# Altium project PIC Circuit.PrjPcb
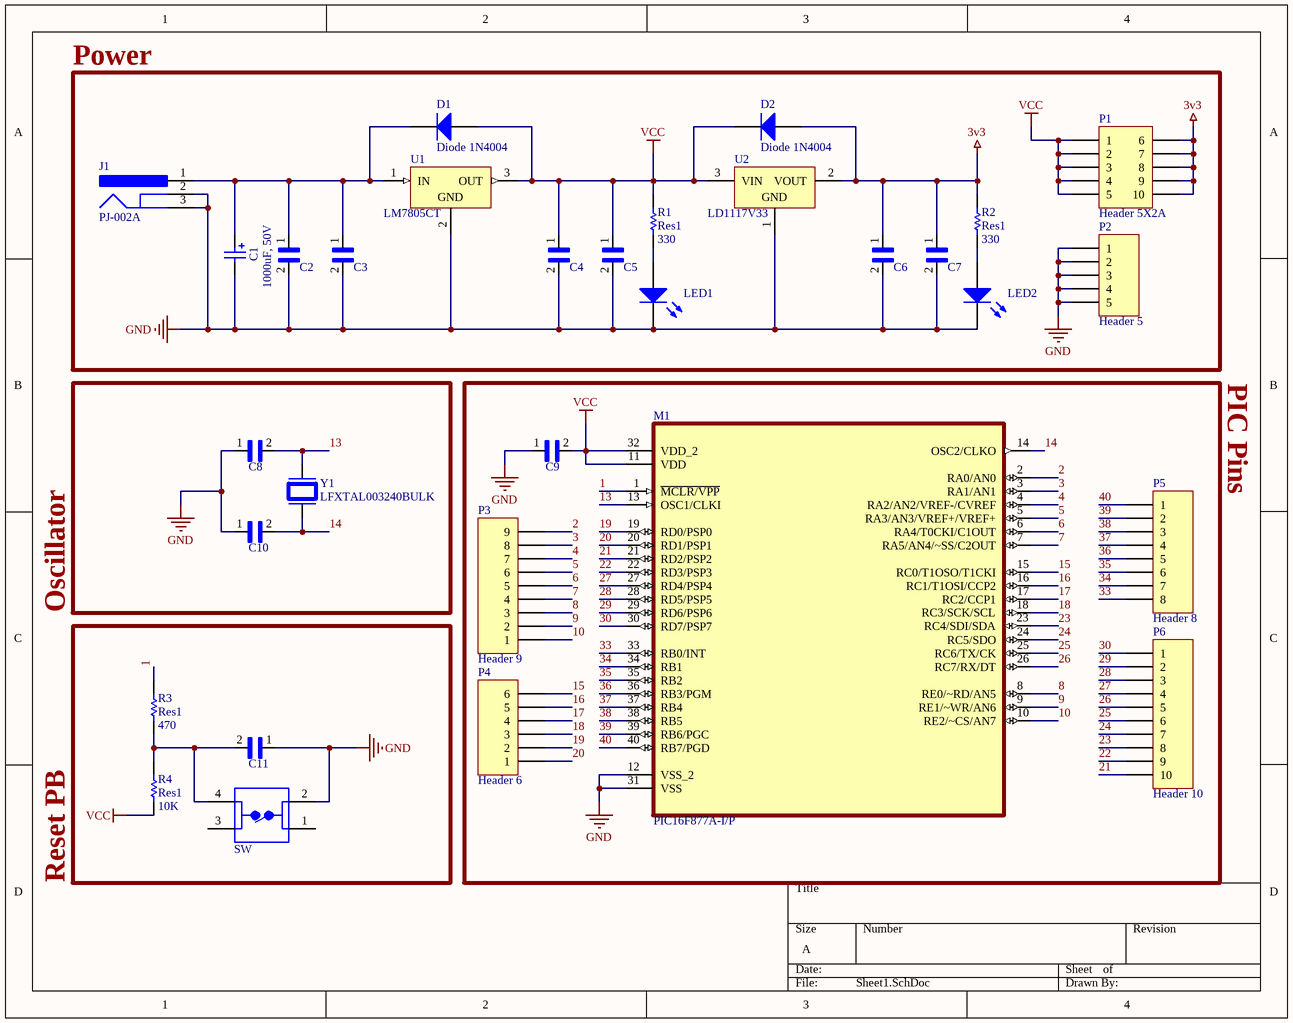
[diagram p0: Sheet1.SchDoc]
1 sheet, 31 parts. Net scope: global (net labels, ports and power ports of the same name join across sheets).
Board file: PCB1.PcbDoc

## Sheet Sheet1.SchDoc
size A; SheetNumber: 1; SheetTotal: 1

### Parts
C1  1000uF, 50V  [WCAP-ATG8_D13H25]
C2  RDE5C2A220J0M1H03A  [CAP_RDE5C2A220J0M1H03A]  (value not drawn)
C3  RDE5C2A220J0M1H03A  [CAP_RDE5C2A220J0M1H03A]  (value not drawn)
C4  RDE5C2A220J0M1H03A  [CAP_RDE5C2A220J0M1H03A]  (value not drawn)
C5  RDE5C2A220J0M1H03A  [CAP_RDE5C2A220J0M1H03A]  (value not drawn)
C6  RDE5C2A220J0M1H03A  [CAP_RDE5C2A220J0M1H03A]  (value not drawn)
C7  RDE5C2A220J0M1H03A  [CAP_RDE5C2A220J0M1H03A]  (value not drawn)
C8  RDE5C2A220J0M1H03A  [CAP_RDE5C2A220J0M1H03A]  (value not drawn)
C9  RDE5C2A220J0M1H03A  [CAP_RDE5C2A220J0M1H03A]  (value not drawn)
C10  RDE5C2A220J0M1H03A  [CAP_RDE5C2A220J0M1H03A]  (value not drawn)
C11  RDE5C2A220J0M1H03A  [CAP_RDE5C2A220J0M1H03A]  (value not drawn)
D1  Diode 1N4004  [DO-41]
D2  Diode 1N4004  [DO-41]
J1  PJ-002A  [CUI-PJ-002A_V]
LED1  151031SS06000  [Type 3mm]  (value not drawn)
LED2  151031SS06000  [Type 3mm]  (value not drawn)
M1  PIC16F877A-I/P  [DIP254P1524X483-40]
P1  Header 5X2A  [HDR2X5_CEN]
P2  Header 5  [HDR1X5]
P3  Header 9  [HDR1X9]
P4  Header 6  [HDR1X6]
P5  Header 8  [HDR1X8]
P6  Header 10  [HDR1X10]
R1  Res1  value 330  [AXIAL-0.3]
R2  Res1  value 330  [AXIAL-0.3]
R3  Res1  value 470  [AXIAL-0.3]
R4  Res1  value 10K  [AXIAL-0.3]
SW  3-1825910-1  [TE_3-1825910-1]  (value not drawn)
U1  LM7805CT  [FAIR-TO-220-3]
U2  LD1117V33  [TO220]
Y1  LFXTAL003240BULK  [HC49P488W45L1105T470H410]

### Blocks framed on the sheet
Power: C1-C7 D1 D2 J1 LED1 LED2 P1 P2 R1 R2 U1 U2
Oscillator: C8 C10 Y1
PIC Pins: C9 M1 P3-P6
Reset PB: C11 R3 R4 SW

### Nets
3v3: C6.1 C7.1 D2.1(A) P1.6 P1.7 P1.8 P1.9 P1.10 R2.1 U2.2(VOUT)
GND: C1.2(N) C2.2 C3.2 C4.2 C5.2 C6.2 C7.2 C8.1 C9.1 C10.1 C11.1 J1.2 J1.3 LED1.1(K) LED2.1(K) M1.12(VSS_2) M1.31(VSS) P2.1 P2.2 P2.3 P2.4 P2.5 SW.2 U1.2(GND) U2.1(GND)
VCC: C4.1 C5.1 C9.2 D1.1(A) D2.2(K) M1.11(VDD) M1.32(VDD_2) P1.1 P1.2 P1.3 P1.4 P1.5 R1.1 R4.1 U1.3(OUT) U2.3(VIN)
1: M1.1(~{MCLR/VPP}) R3.2
2: M1.2(RA0/AN0) P3.9
3: M1.3(RA1/AN1) P3.8
4: M1.4(RA2/AN2/VREF-/CVREF) P3.7
5: M1.5(RA3/AN3/VREF+/VREF+) P3.6
6: M1.6(RA4/T0CKI/C1OUT) P3.5
7: M1.7(RA5/AN4/~SS/C2OUT) P3.4
8: M1.8(RE0/~RD/AN5) P3.3
9: M1.9(RE1/~WR/AN6) P3.2
10: M1.10(RE2/~CS/AN7) P3.1
13: C8.2 M1.13(OSC1/CLKI) Y1.2
14: C10.2 M1.14(OSC2/CLKO) Y1.1
15: M1.15(RC0/T1OSO/T1CKI) P4.6
16: M1.16(RC1/T1OSI/CCP2) P4.5
17: M1.17(RC2/CCP1) P4.4
18: M1.18(RC3/SCK/SCL) P4.3
19: M1.19(RD0/PSP0) P4.2
20: M1.20(RD1/PSP1) P4.1
21: M1.21(RD2/PSP2) P6.10
22: M1.22(RD3/PSP3) P6.9
23: M1.23(RC4/SDI/SDA) P6.8
24: M1.24(RC5/SDO) P6.7
25: M1.25(RC6/TX/CK) P6.6
26: M1.26(RC7/RX/DT) P6.5
27: M1.27(RD4/PSP4) P6.4
28: M1.28(RD5/PSP5) P6.3
29: M1.29(RD6/PSP6) P6.2
30: M1.30(RD7/PSP7) P6.1
33: M1.33(RB0/INT) P5.8
34: M1.34(RB1) P5.7
35: M1.35(RB2) P5.6
36: M1.36(RB3/PGM) P5.5
37: M1.37(RB4) P5.4
38: M1.38(RB5) P5.3
39: M1.39(RB6/PGC) P5.2
40: M1.40(RB7/PGD) P5.1
NetC1_1: C1.1(P) C2.1 C3.1 D1.2(K) J1.1 U1.1(IN)
NetC11_2: C11.2 R3.1 R4.2 SW.4
NetLED1_2: LED1.2(A) R1.2
NetLED2_2: LED2.2(A) R2.2

Not connected (* = marked no-connect by the designer): SW 1 3

### Library data of the parts
C1 = 860010678024: WCAP-ATG8 Aluminum Electrolytic Capacitor, Radial, THT, D13xH25, 1000uF, 50V; Manufacturer: Wurth Elektronik; Ripple Current: 1485mA; Rated Voltage: 50VDC; Technical Reference: ATBI250102M050DSPACB000; Leakage Current: 500uA; Endurance: 2000h; Dissipation Factor: 10%; Capacitance Tolerance: +/-20%; ComponentLink2Description: Datasheet; Published Date: October 2020; Packaging: Ammo Pack; Operating Temperature: -40 to +85degC; Mounting Technology: THT; Manufacturer Part Number: 860010678024; Height: 25mm; Diameter: 13mm; ComponentLink2URL: https://www.we-online.com/catalog/datasheet/860010678024.pdf; ComponentLink1URL: http://www.we-online.de; ComponentLink1Description: Manufacturer; Capacitance: 1000uF
C2-C11 = RDE5C2A220J0M1H03A: Lead Capacitor C0G_EIA_ with Capacitance: 22pF and Rated Voltage: 100Vdc; MF: Murata; Availability: Unavailable; Price: None; Package: Radial Murata; Value: *; SnapEDA_Link: https://www.snapeda.com/parts/RDE5C2A220J0M1H03A/Murata/view-part/4545539/?ref=snap; MP: RDE5C2A220J0M1H03A
D1 D2 = Diode 1N4004: 1 Amp General Purpose Rectifier; Published: 8-Jun-2000; LatestRevisionDate: 17-Jul-2002; LatestRevisionNote: Re-released for DXP Platform.; DatasheetVersion: 1998; PackageVersion: Aug-1999; PackageReference: DO-41; Publisher: Altium Limited; PackageDescription: Diode, Axial; Body 5.2 x 2.7 mm (LxDia. max), Lead Dia. 0.86 mm (max); Code_JEDEC: DO-204-AL; ComponentLink1Description: Manufacturer Link; ComponentLink1URL: http://www.fairchildsemi.com/; ComponentLink2Description: Datasheet; ComponentLink2URL: http://www.fairchildsemi.com/ds/1N%2F1N4001.pdf
J1 = CMP-2000-06895-1: Through Hole Right Angle DC Power Jack, 2.5 A, 2 mm Center Pin, 3 Position, -25 to 85 degC, RoHS, Bulk; Manufacturer: CUIInc.; Current Rating: 2.5A; Inside Contact Diameter: 2mm; Insulation Resistance: 50MOhms; Outside Contact Diameter: 6.5mm; Voltage Rating: 24V; Brand: CUI; Operating Temperature Range: -25Cto+85C; Mounting Technology: ThroughHole; Connector Type: DCPowerJack; Contact Material: Copper; Datasheet URL: http://www.cui.com/product/resource/pj-002a.pdf; Contact Gender: Male; Housing Material: PolybutyleneTerephthalate(PBT); Manufacturer URL: http://www.cui.com/; Package Reference: PJ-002A; Mounting Style: ThroughHole; Mounting Angle: Right; Product Category: DCPowerConnectors; Product: Jacks; Flammability Rating: UL94V-0; Contact Plating: Nickel; RoHS: True; Datasheet Version: Rev. 1.03, 04/2016; Package Description: 3-Pin Through Hole Device, Body 14.4 x 9 mm, Height 11 mm; Factory Pack Quantity: 500; Termination Style: ThroughHole
LED1 LED2 = CMP-1488-00002-1: THT LED round mono-color color lens, WL-TMRW, Super Red; Manufacturer: Wuerth Elektronik; ComponentLink2URL: http://katalog.we-online.de/pbs/datasheet/7448042001.pdfhttp://katalog.we-online.de/pbs/datasheet/7448042001.pdfhttp://katalog.we-online.de/pbs/datasheet/7448042001.pdfhttp://katalog.we-online.de/pbs/datasheet/151031SS06000.pdf; ComponentLink1URL: http://www.we-online.com; PartNumber: 151031SS06000; ComponentLink2Description: Datasheet; PackageReference: Type 3mm; Emitting color: Super Red; ComponentLink1Description: Manufacturer URL
M1 = PIC16F877A-I/P: PIC PICÂ® 16F Microcontroller IC 8-Bit 20MHz 14KB _8K x 14_ FLASH 40-PDIP; MF: Microchip; MP: PIC16F877A-I/P; Package: DIP-40 Microchip; Price: None; Value: *; SnapEDA_Link: https://www.snapeda.com/parts/PIC16F877A-I/P/Microchip/view-part/1877145/?ref=snap; Availability: Unavailable
P1 = Header 5X2A: Header, 5-Pin, Dual row; LatestRevisionDate: 17-Jul-2002; LatestRevisionNote: Re-released for DXP Platform.; Publisher: Altium Limited
P2 = Header 5: Header, 5-Pin; LatestRevisionDate: 17-Jul-2002; LatestRevisionNote: Re-released for DXP Platform.; Publisher: Altium Limited
P3 = Header 9: Header, 9-Pin; LatestRevisionDate: 17-Jul-2002; LatestRevisionNote: Re-released for DXP Platform.; Publisher: Altium Limited
P4 = Header 6: Header, 6-Pin; LatestRevisionDate: 17-Jul-2002; LatestRevisionNote: Re-released for DXP Platform.; Publisher: Altium Limited
P5 = Header 8: Header, 8-Pin; LatestRevisionDate: 17-Jul-2002; LatestRevisionNote: Re-released for DXP Platform.; Publisher: Altium Limited
P6 = Header 10: Header, 10-Pin; LatestRevisionDate: 17-Jul-2002; LatestRevisionNote: Re-released for DXP Platform.; Publisher: Altium Limited
R1-R4 = Res1: Resistor; Published: 8-Jun-2000; LatestRevisionDate: 17-Jul-2002; LatestRevisionNote: Re-released for DXP Platform.; PackageReference: AXIAL-0.3; Publisher: Altium Limited; PackageDescription: Axial Device, Thru-Hole; 2 Leads; 0.3 in Pin Spacing
SW = 3-1825910-1: Switch Push Button OFF _ON_ SPST Round Button 0.05A 24VDC Momentary Contact PC Pins Thru-Hole; MF: TE Connectivity; Availability: Unavailable; SnapEDA_Link: https://www.snapeda.com/parts/3-1825910-1/TE%20Connectivity%20ALCOSWITCH%20Switches/view-part/452461/?ref=snap; Price: None; EU_RoHS_Compliance: Compliant; Package: None; TE_purchase_URL: https://www.te.com/usa-en/product-3-1825910-1.html?te_bu=Cor&te_type=disp&te_campaign=seda_glo_cor-seda-global-disp-prtnr-fy19-seda-model-bom-cta_sma-317_1&elqCampaignId=32493; MP: 3-1825910-1; Value: *
U1 = CMP-2000-04938-1: Positive Voltage Regulator, 5 V, 1 A, -40 to 125 degC, 3-Pin TO-220, RoHS, Tube; Manufacturer: FairchildSemiconductor; Maximum Input Voltage: 35V; Maximum Quiescent Current: 8mA; Load Regulation: 100mV; Maximum Output Current: 2.2(Typ)A; Output Type: Fixed; Typical Dropout Voltage @ Current: 2@1AV; Rad Hard: No; Output Voltage: 5V; Accuracy: ±4%; Number of Outputs: 1; Category: LinearRegulator; Package Description: 3-Pin Through Hole Device, Body 10 x 4.5 mm, Pitch 2.54 mm; Packaging: Rail/Tube; Mounting: ThroughHole; Polarity: Positive; Manufacturer URL: https://www.fairchildsemi.com/; Line Regulation: 100mV; Datasheet Version: Aug-12; Datasheet URL: https://datasheet.ciiva.com/26904/lm7805ct-26904988.pdf; Package Reference: TO-220; Package URL: https://www.fairchildsemi.com/package-drawings/TO/TO220B03.pdf; Package: 3TO-220AB; Operating Temperature: -40to125degC; Type: Linear
U2 = CMP-0244-00470-1: Fixed Low Drop Positive Voltage Regulator, 3.3V, 3-Pin TO-220; PackageVersion: ver3.0; PackageDescription: TO, Thru-Hole, Vertical, Heatsink Mounted; 3 In-Line Leads; Pitch 2.54 mm; ComponentLink1Description: Manufacturer URL; ComponentLink3URL: http://www.st.com/internet/com/TECHNICAL_RESOURCES/TECHNICAL_LITERATURE/PACKAGE_INFORMATION/CD00004649.pdf; PackageReference: TO220; ComponentLink2URL: http://www.st.com/internet/com/TECHNICAL_RESOURCES/TECHNICAL_LITERATURE/DATASHEET/CD00000544.pdf; ComponentLink3Description: Package Specification; ComponentLink2Description: Datasheet; ComponentLink1URL: http://www.st.com; DatasheetVersion: 1/11/2011
Y1 = LFXTAL003240BULK: 16MHz Â±30ppm Crystal 30pF 40 Ohms HC-49/US; MF: IQD Frequency Products; MP: LFXTAL003240BULK; Price: None; SnapEDA_Link: https://www.snapeda.com/parts/LFXTAL003240BULK/IQD%20Frequency%20Products/view-part/2463585/?ref=snap; Availability: Unavailable; Value: *; Package: HC-49/US IQD Frequency Products